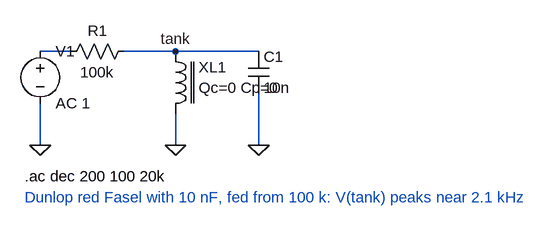
[diagram p0: schematic demo_wah-inductor.asc]
demo_wah-inductor.asc, the LTspice schematic file:
Version 4
SHEET 1 760 360
WIRE 96 80 144 80
WIRE 224 80 304 80
WIRE 304 80 432 80
WIRE 96 160 96 224
WIRE 304 176 304 224
WIRE 432 144 432 224
FLAG 96 224 0
FLAG 304 224 0
FLAG 432 224 0
FLAG 304 80 tank
SYMBOL voltage 96 64 R0
SYMATTR InstName V1
SYMATTR Value AC 1
SYMBOL res 240 64 R90
WINDOW 0 0 56 VBottom 2
WINDOW 3 32 56 VTop 2
SYMATTR InstName R1
SYMATTR Value 100k
SYMBOL WAH_RED_FASEL 288 64 R0
SYMATTR InstName XL1
SYMATTR Value Qc=0 Cp=0
SYMBOL cap 416 80 R0
SYMATTR InstName C1
SYMATTR Value 10n
TEXT 72 272 Left 2 !.ac dec 200 100 20k
TEXT 72 304 Left 2 ;Dunlop red Fasel with 10 nF, fed from 100 k: V(tank) peaks near 2.1 kHz

The netlist it stands for:
* demo_wah-inductor.asc
V1 N001 0 AC 1
R1 tank N001 100k
XXL1 tank 0 WAH_RED_FASEL Qc=0 Cp=0  ; pins A B
C1 tank 0 10n
.ac dec 200 100 20k
* Dunlop red Fasel with 10 nF, fed from 100 k: V(tank) peaks near 2.1 kHz
.lib wah-inductor.sub
.backanno
.end